# Altium schematic sheet heater_control.SchDoc
size A4; DocumentNumber: 4; SheetNumber: 4; SheetTotal: 11
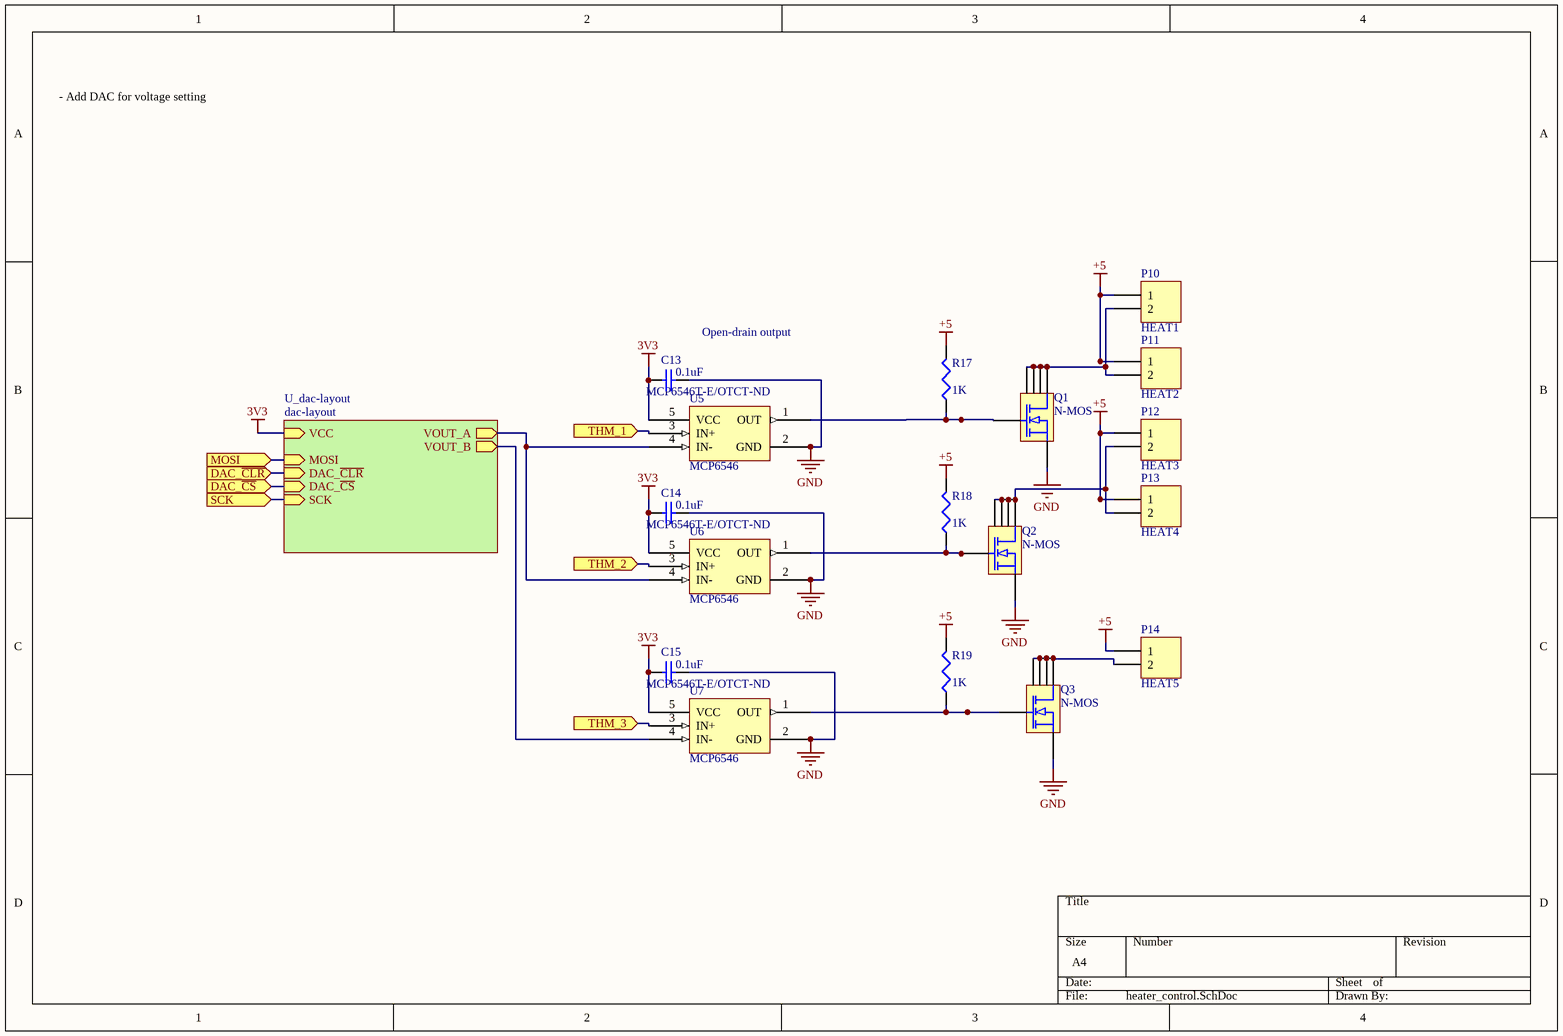
[diagram p0: heater_control.SchDoc]

## Parts
C13  0.1uF  [1608[0603]]
C14  0.1uF  [1608[0603]]
C15  value 0.1uF  [1608[0603]]  (hidden comment: 100pF)
P10  HEAT1  [DF14-2P-1.25H(55)]
P11  HEAT2  [DF14-2P-1.25H(55)]
P12  HEAT3  [DF14-2P-1.25H(55)]
P13  HEAT4  [DF14-2P-1.25H(55)]
P14  HEAT5  [DF14-2P-1.25H(55)]
Q1  N-MOS  [SOT23-6_N]
Q2  N-MOS  [SOT23-6_N]
Q3  N-MOS  [SOT23-6_N]
R17  1K  [J1-0603]
R18  1K  [J1-0603]
R19  1K  [J1-0603]
U5  MCP6546  Supplier Part Number 1: MCP6546T-E/OTCT-ND  [SOT-23-5_95P290X160-5N]
U6  MCP6546  Supplier Part Number 1: MCP6546T-E/OTCT-ND  [SOT-23-5_95P290X160-5N]
U7  MCP6546  Supplier Part Number 1: MCP6546T-E/OTCT-ND  [SOT-23-5_95P290X160-5N]

## Sub-sheets
U_dac-layout = dac-layout: VOUT_A (out), VOUT_B (out), DAC_~{CS} (in), SCK (in), MOSI (in), DAC_~{CLR} (in), VCC (in)

## Ports
DAC_~{CLR} (in), DAC_~{CS} (in), MOSI (in), SCK (in), THM_1 (in), THM_2 (in), THM_3 (in)

## Nets
3V3: C13.1 C14.1 C15.1 U5.5(VCC) U6.5(VCC) U7.5(VCC) ; sheet U_dac-layout/VCC
+5: P10.1 P11.1 P12.1 P13.1 P14.1 R17.2 R18.2 R19.2
GND: C13.2 C14.2 C15.2 Q1.4(S) Q2.4(S) Q3.4(S) U5.2(GND) U6.2(GND) U7.2(GND)
DAC_~{CLR}: port DAC_~{CLR}, sheet U_dac-layout/DAC_~{CLR}
DAC_~{CS}: port DAC_~{CS}, sheet U_dac-layout/DAC_~{CS}
MOSI: port MOSI, sheet U_dac-layout/MOSI
SCK: port SCK, sheet U_dac-layout/SCK
THM_1: U5.3(IN+) ; port THM_1
THM_2: U6.3(IN+) ; port THM_2
THM_3: U7.3(IN+) ; port THM_3
NetP10_2: P10.2 P11.2 Q1.1(D) Q1.2(D) Q1.5(D) Q1.6(D)
NetP12_2: P12.2 P13.2 Q2.1(D) Q2.2(D) Q2.5(D) Q2.6(D)
NetP14_2: P14.2 Q3.1(D) Q3.2(D) Q3.5(D) Q3.6(D)
NetQ1_3: Q1.3(G) R17.1 U5.1(OUT)
NetQ2_3: Q2.3(G) R18.1 U6.1(OUT)
NetQ3_3: Q3.3(G) R19.1 U7.1(OUT)
NetU5_4: U5.4(IN-) U6.4(IN-) ; sheet U_dac-layout/VOUT_A
NetU7_4: U7.4(IN-) ; sheet U_dac-layout/VOUT_B

## Notes on the sheet
- - Add DAC for voltage setting
- When THM below reference (cold), output is high impedance and MOSFET is ON
  When THM above reference (hot) output is connected to GND and MOSFET is OFF
- MOSFET ON connects the heaters to GND, which turns them ON
- (near C13) Open-drain output

## Library data of the parts
C13-C15 = Cap Semi: Capacitor (Semiconductor SIM Model); Published: 8-Jun-2000; LatestRevisionDate: 29-May-2009; LatestRevisionNote: IPC-7351 Footprint Added.; PackageReference: C1206; Publisher: Altium Limited; PackageDescription: Chip Capacitor; Supplier: Digi-Key
  C13 C14: Value: 0.1uF; Supplier Part Number: 587-3807-1-ND
  C15: Supplier Part Number: 1276-1972-1-ND
P10-P14 = Header 2: Header, 2-Pin; LatestRevisionDate: 17-Jul-2002; LatestRevisionNote: Re-released for DXP Platform.; Publisher: Altium Limited; Supplier: Digi-Key
Q1-Q3 = FDC637BNZCT-ND: N-MOS, low gate ON voltage; Supplier: Digi-Key; Supplier Part Number: FDC637BNZCT-ND
R17-R19 = Res3: Resistor; Published: 8-Jun-2000; LatestRevisionDate: 29-May-2009; LatestRevisionNote: IPC-7351 Footprint Added.; PackageReference: J1-0603; Publisher: Altium Limited; PackageDescription: Chip Resistor; Value: 1K; Supplier: Digi-Key
U5-U7 = MCP6546: Open-drain output sub-microamp comparator.; Supplier 1: Digi-Key